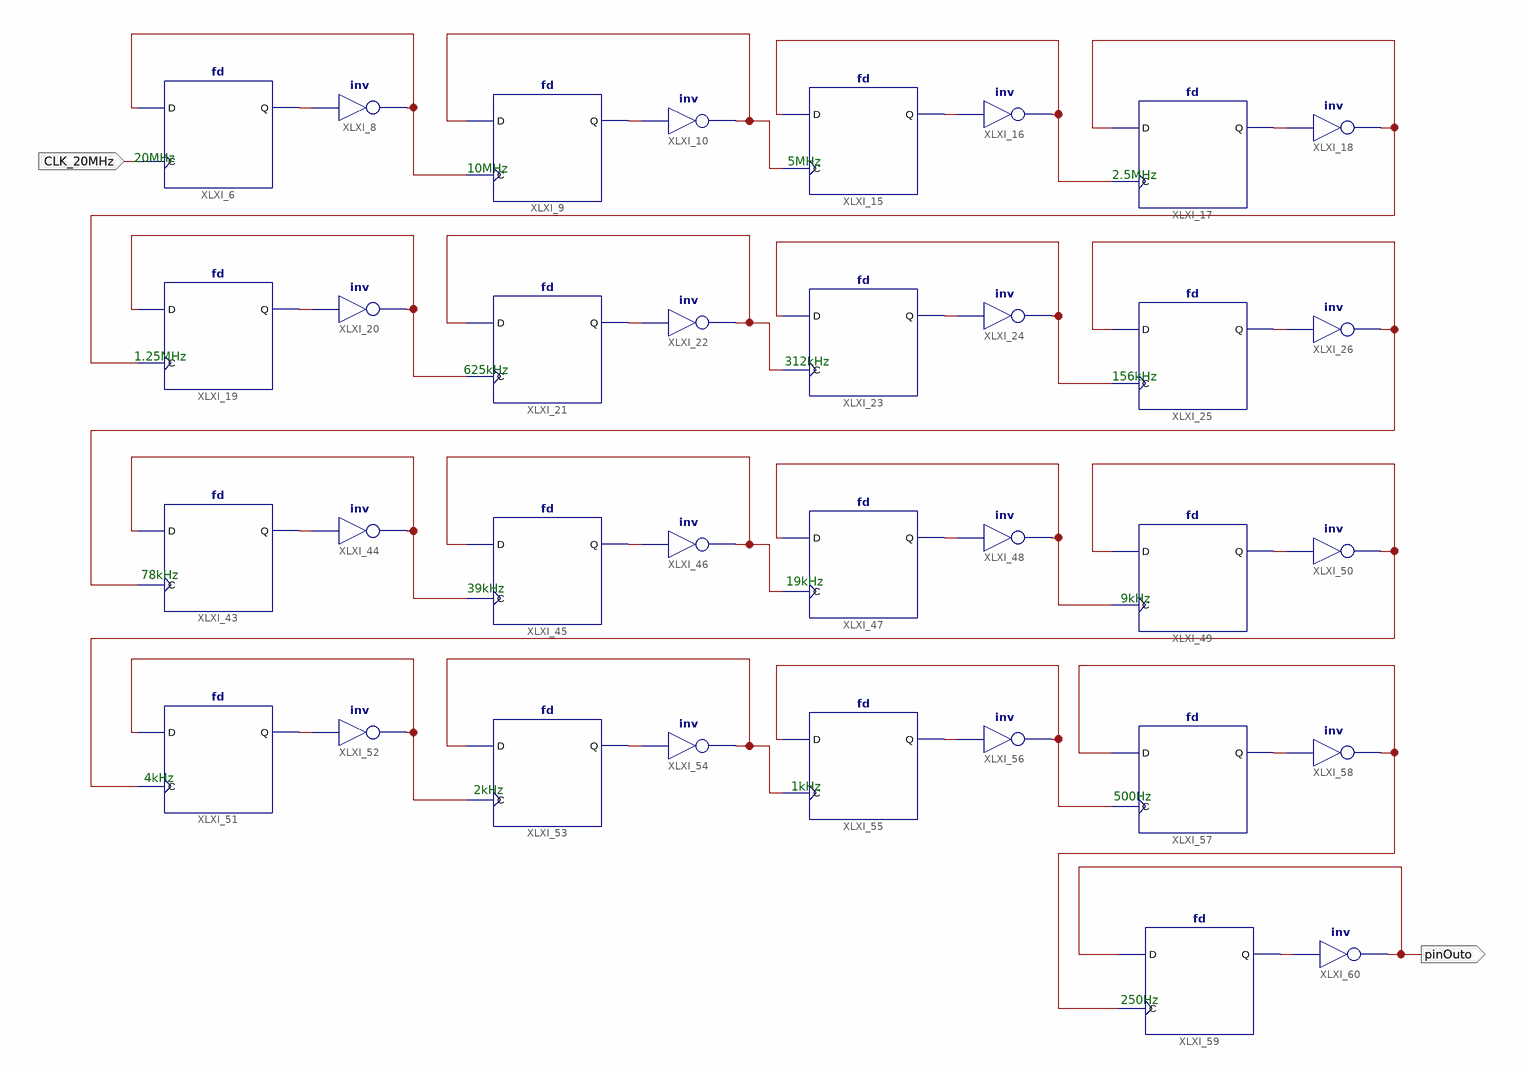
[diagram p0: schematic sheet 1]
// Xilinx ISE schematic ClockDivider.sch (spartan6) as structural Verilog: 34 symbols, 2 ports
module ClockDivider (
  input  CLK_20MHz,
  output pinOuto
);

  wire XLXN_2, XLXN_3, XLXN_5, XLXN_7, XLXN_14, XLXN_15, XLXN_16, XLXN_17, XLXN_19, XLXN_20, XLXN_21,
       XLXN_22, XLXN_23, XLXN_24, XLXN_25, XLXN_26, XLXN_46, XLXN_47, XLXN_48, XLXN_49, XLXN_50, XLXN_51,
       XLXN_52, XLXN_54, XLXN_55, XLXN_56, XLXN_57, XLXN_58, XLXN_59, XLXN_60, XLXN_61, XLXN_64, XLXN_68;

  fd XLXI_6 (.C(CLK_20MHz), .D(XLXN_3), .Q(XLXN_2));
  not XLXI_8 (XLXN_3, XLXN_2);
  fd XLXI_9 (.C(XLXN_3), .D(XLXN_7), .Q(XLXN_5));
  not XLXI_10 (XLXN_7, XLXN_5);
  fd XLXI_15 (.C(XLXN_7), .D(XLXN_15), .Q(XLXN_14));
  not XLXI_16 (XLXN_15, XLXN_14);
  fd XLXI_17 (.C(XLXN_15), .D(XLXN_17), .Q(XLXN_16));
  not XLXI_18 (XLXN_17, XLXN_16);
  fd XLXI_19 (.C(XLXN_17), .D(XLXN_20), .Q(XLXN_19));
  not XLXI_20 (XLXN_20, XLXN_19);
  fd XLXI_21 (.C(XLXN_20), .D(XLXN_22), .Q(XLXN_21));
  not XLXI_22 (XLXN_22, XLXN_21);
  fd XLXI_23 (.C(XLXN_22), .D(XLXN_24), .Q(XLXN_23));
  not XLXI_24 (XLXN_24, XLXN_23);
  fd XLXI_25 (.C(XLXN_24), .D(XLXN_26), .Q(XLXN_25));
  not XLXI_26 (XLXN_26, XLXN_25);
  fd XLXI_43 (.C(XLXN_26), .D(XLXN_47), .Q(XLXN_46));
  not XLXI_44 (XLXN_47, XLXN_46);
  fd XLXI_45 (.C(XLXN_47), .D(XLXN_49), .Q(XLXN_48));
  not XLXI_46 (XLXN_49, XLXN_48);
  fd XLXI_47 (.C(XLXN_49), .D(XLXN_51), .Q(XLXN_50));
  not XLXI_48 (XLXN_51, XLXN_50);
  fd XLXI_49 (.C(XLXN_51), .D(XLXN_54), .Q(XLXN_52));
  not XLXI_50 (XLXN_54, XLXN_52);
  fd XLXI_51 (.C(XLXN_54), .D(XLXN_56), .Q(XLXN_55));
  not XLXI_52 (XLXN_56, XLXN_55);
  fd XLXI_53 (.C(XLXN_56), .D(XLXN_58), .Q(XLXN_57));
  not XLXI_54 (XLXN_58, XLXN_57);
  fd XLXI_55 (.C(XLXN_58), .D(XLXN_60), .Q(XLXN_59));
  not XLXI_56 (XLXN_60, XLXN_59);
  fd XLXI_57 (.C(XLXN_60), .D(XLXN_68), .Q(XLXN_61));
  not XLXI_58 (XLXN_68, XLXN_61);
  fd XLXI_59 (.C(XLXN_68), .D(pinOuto), .Q(XLXN_64));
  not XLXI_60 (pinOuto, XLXN_64);

  // Notes on the sheet:
  //   20MHz
  //   5MHz
  //   10MHz
  //   2.5MHz
  //   1.25MHz
  //   312kHz
  //   625kHz
  //   156kHz
  //   78kHz
  //   19kHz
  //   39kHz
  //   9kHz
  //   4kHz
  //   1kHz
  //   2kHz
  //   500Hz
  //   250Hz
endmodule
